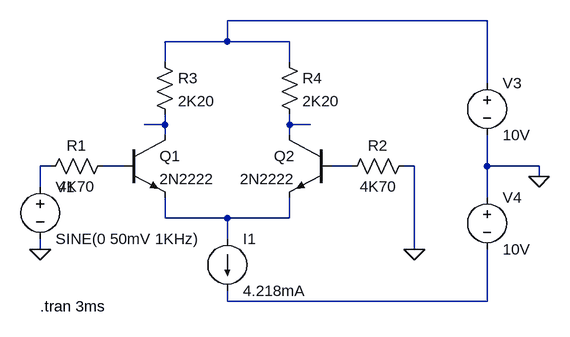
[diagram p0: schematic Exp4_PreLab_P1.asc]
Exp4_PreLab_P1.asc, the LTspice schematic file:
Version 4
SHEET 1 880 680
WIRE 544 -240 144 -240
WIRE 144 -208 144 -240
WIRE 144 -208 48 -208
WIRE 240 -208 144 -208
WIRE 48 -176 48 -208
WIRE 240 -176 240 -208
WIRE 544 -144 544 -240
WIRE 48 -80 48 -96
WIRE 48 -80 16 -80
WIRE 240 -80 240 -96
WIRE 272 -80 240 -80
WIRE 48 -64 48 -80
WIRE 240 -64 240 -80
WIRE -128 -16 -144 -16
WIRE -16 -16 -48 -16
WIRE 336 -16 304 -16
WIRE 432 -16 416 -16
WIRE 544 -16 544 -64
WIRE 624 -16 544 -16
WIRE 624 0 624 -16
WIRE -144 16 -144 -16
WIRE 432 112 432 -16
WIRE 544 32 544 -16
WIRE 48 64 48 32
WIRE 144 64 48 64
WIRE 240 64 240 32
WIRE 240 64 144 64
WIRE 144 96 144 64
WIRE -144 112 -144 96
WIRE 144 192 144 176
WIRE 544 192 544 112
WIRE 544 192 144 192
FLAG -144 112 0
FLAG 432 112 0
FLAG 624 0 0
SYMBOL res -32 -32 R90
WINDOW 0 0 56 VBottom 2
WINDOW 3 32 56 VTop 2
SYMATTR InstName R1
SYMATTR Value 4K70
SYMBOL npn -16 -64 R0
SYMATTR InstName Q1
SYMATTR Value 2N2222
SYMBOL npn 304 -64 M0
SYMATTR InstName Q2
SYMATTR Value 2N2222
SYMBOL res 432 -32 R90
WINDOW 0 0 56 VBottom 2
WINDOW 3 32 56 VTop 2
SYMATTR InstName R2
SYMATTR Value 4K70
SYMBOL res 32 -192 R0
SYMATTR InstName R3
SYMATTR Value 2K20
SYMBOL res 224 -192 R0
SYMATTR InstName R4
SYMATTR Value 2K20
SYMBOL voltage 544 -160 R0
SYMATTR InstName V3
SYMATTR Value 10V
SYMBOL voltage 544 16 R0
SYMATTR InstName V4
SYMATTR Value 10V
SYMBOL current 144 96 R0
SYMATTR InstName I1
SYMATTR Value 4.218mA
SYMBOL voltage -144 0 R0
SYMATTR InstName V1
SYMATTR Value SINE(0 50mV 1KHz)
TEXT -144 200 Left 2 !.tran 3ms

The netlist it stands for:
* Exp4_PreLab_P1.asc
R1 N005 N004 4K70
Q1 N002 N005 N007 0 2N2222
Q2 N003 N006 N007 0 2N2222
R2 0 N006 4K70
R3 N001 N002 2K20
R4 N001 N003 2K20
V3 N001 0 10V
V4 0 N008 10V
I1 N007 N008 4.218mA
V1 N004 0 SINE(0 50mV 1KHz)
.model NPN NPN
.model PNP PNP
.lib standard.bjt
.tran 3ms
.backanno
.end